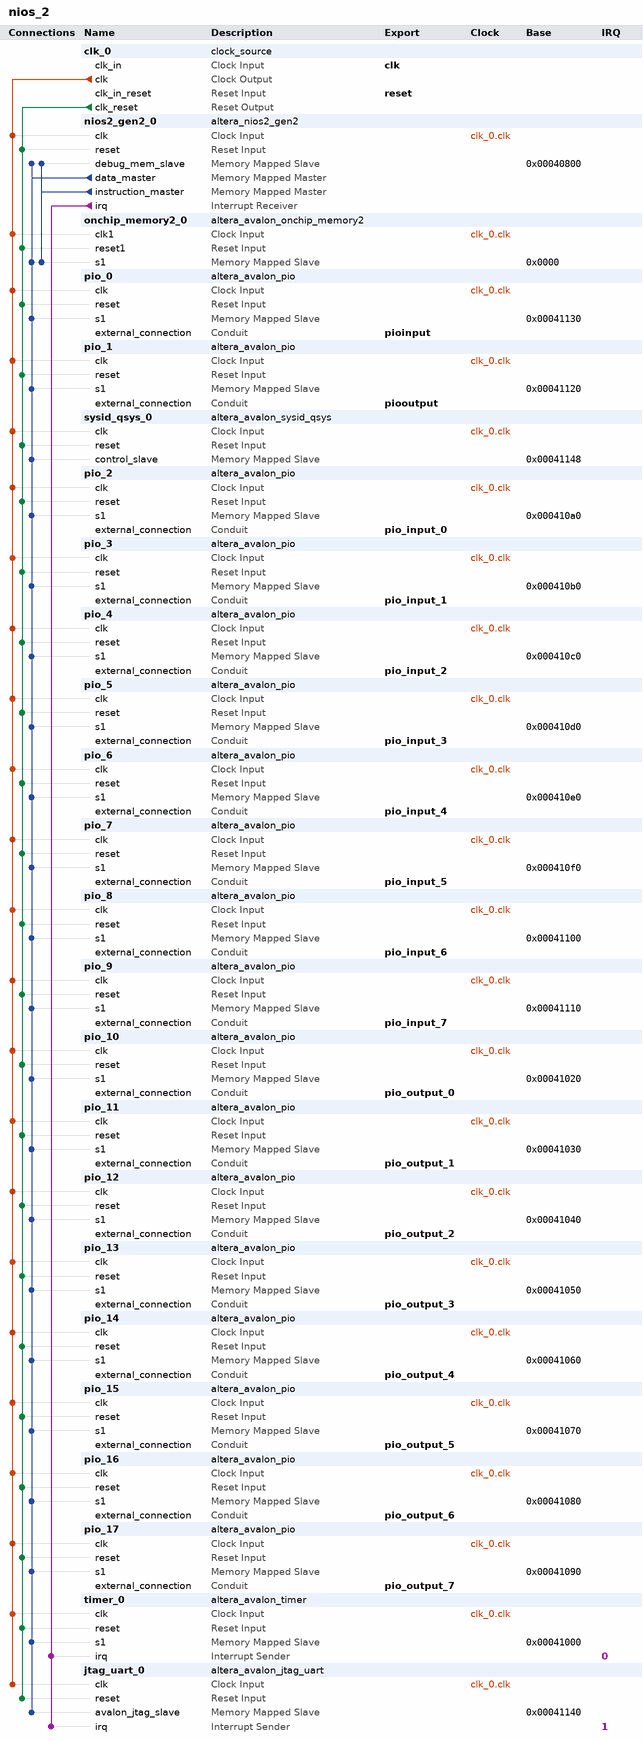
[diagram p0: system contents]
# Platform Designer (Qsys) system nios_2, Cyclone V 5CSEMA5F31C6
# Parameters at their usual value, and those the tool derives, are not listed.
package require -exact qsys 18.0
create_system nios_2
set_project_property DEVICE_FAMILY {Cyclone V}
set_project_property DEVICE 5CSEMA5F31C6

add_instance clk_0 clock_source 18.0
set_instance_parameter_value clk_0 clockFrequency 50000000

add_instance nios2_gen2_0 altera_nios2_gen2 18.0
set_instance_parameter_value nios2_gen2_0 dcache_size 2048
set_instance_parameter_value nios2_gen2_0 exceptionSlave onchip_memory2_0.s1
set_instance_parameter_value nios2_gen2_0 icache_size 4096
set_instance_parameter_value nios2_gen2_0 impl Fast
set_instance_parameter_value nios2_gen2_0 resetSlave onchip_memory2_0.s1

add_instance onchip_memory2_0 altera_avalon_onchip_memory2 18.0
set_instance_parameter_value onchip_memory2_0 dataWidth 32
set_instance_parameter_value onchip_memory2_0 dualPort false
set_instance_parameter_value onchip_memory2_0 initMemContent true
set_instance_parameter_value onchip_memory2_0 initializationFileName onchip_mem.hex
set_instance_parameter_value onchip_memory2_0 memorySize 131072

add_instance pio_0 altera_avalon_pio 18.0
set_instance_parameter_value pio_0 direction Input
set_instance_parameter_value pio_0 width 8

add_instance pio_1 altera_avalon_pio 18.0
set_instance_parameter_value pio_1 direction Output
set_instance_parameter_value pio_1 width 8

add_instance sysid_qsys_0 altera_avalon_sysid_qsys 18.0
set_instance_parameter_value sysid_qsys_0 id 0

add_instance pio_2 altera_avalon_pio 18.0
set_instance_parameter_value pio_2 direction Input
set_instance_parameter_value pio_2 width 8

add_instance pio_3 altera_avalon_pio 18.0
set_instance_parameter_value pio_3 direction Input
set_instance_parameter_value pio_3 width 8

add_instance pio_4 altera_avalon_pio 18.0
set_instance_parameter_value pio_4 direction Input
set_instance_parameter_value pio_4 width 8

add_instance pio_5 altera_avalon_pio 18.0
set_instance_parameter_value pio_5 direction Input
set_instance_parameter_value pio_5 width 8

add_instance pio_6 altera_avalon_pio 18.0
set_instance_parameter_value pio_6 direction Input
set_instance_parameter_value pio_6 width 8

add_instance pio_7 altera_avalon_pio 18.0
set_instance_parameter_value pio_7 direction Input
set_instance_parameter_value pio_7 width 8

add_instance pio_8 altera_avalon_pio 18.0
set_instance_parameter_value pio_8 direction Input
set_instance_parameter_value pio_8 width 8

add_instance pio_9 altera_avalon_pio 18.0
set_instance_parameter_value pio_9 direction Input
set_instance_parameter_value pio_9 width 8

add_instance pio_10 altera_avalon_pio 18.0
set_instance_parameter_value pio_10 direction Output
set_instance_parameter_value pio_10 width 8

add_instance pio_11 altera_avalon_pio 18.0
set_instance_parameter_value pio_11 direction Output
set_instance_parameter_value pio_11 width 8

add_instance pio_12 altera_avalon_pio 18.0
set_instance_parameter_value pio_12 direction Output
set_instance_parameter_value pio_12 width 8

add_instance pio_13 altera_avalon_pio 18.0
set_instance_parameter_value pio_13 direction Output
set_instance_parameter_value pio_13 width 8

add_instance pio_14 altera_avalon_pio 18.0
set_instance_parameter_value pio_14 direction Output
set_instance_parameter_value pio_14 width 8

add_instance pio_15 altera_avalon_pio 18.0
set_instance_parameter_value pio_15 direction Output
set_instance_parameter_value pio_15 width 8

add_instance pio_16 altera_avalon_pio 18.0
set_instance_parameter_value pio_16 direction Output
set_instance_parameter_value pio_16 width 8

add_instance pio_17 altera_avalon_pio 18.0
set_instance_parameter_value pio_17 direction Output
set_instance_parameter_value pio_17 width 8

add_instance timer_0 altera_avalon_timer 18.0
set_instance_parameter_value timer_0 period 1
set_instance_parameter_value timer_0 periodUnits SEC

add_instance jtag_uart_0 altera_avalon_jtag_uart 18.0
set_instance_parameter_value jtag_uart_0 simInteractiveOptions NO_INTERACTIVE_WINDOWS

# connections
add_connection clk_0.clk jtag_uart_0.clk clock
add_connection clk_0.clk nios2_gen2_0.clk clock
add_connection clk_0.clk onchip_memory2_0.clk1 clock
add_connection clk_0.clk pio_0.clk clock
add_connection clk_0.clk pio_1.clk clock
add_connection clk_0.clk pio_2.clk clock
add_connection clk_0.clk pio_3.clk clock
add_connection clk_0.clk pio_4.clk clock
add_connection clk_0.clk pio_5.clk clock
add_connection clk_0.clk pio_6.clk clock
add_connection clk_0.clk pio_7.clk clock
add_connection clk_0.clk pio_8.clk clock
add_connection clk_0.clk pio_9.clk clock
add_connection clk_0.clk pio_10.clk clock
add_connection clk_0.clk pio_11.clk clock
add_connection clk_0.clk pio_12.clk clock
add_connection clk_0.clk pio_13.clk clock
add_connection clk_0.clk pio_14.clk clock
add_connection clk_0.clk pio_15.clk clock
add_connection clk_0.clk pio_16.clk clock
add_connection clk_0.clk pio_17.clk clock
add_connection clk_0.clk sysid_qsys_0.clk clock
add_connection clk_0.clk timer_0.clk clock
add_connection clk_0.clk_reset jtag_uart_0.reset reset
add_connection clk_0.clk_reset nios2_gen2_0.reset reset
add_connection clk_0.clk_reset onchip_memory2_0.reset1 reset
add_connection clk_0.clk_reset pio_0.reset reset
add_connection clk_0.clk_reset pio_1.reset reset
add_connection clk_0.clk_reset pio_2.reset reset
add_connection clk_0.clk_reset pio_3.reset reset
add_connection clk_0.clk_reset pio_4.reset reset
add_connection clk_0.clk_reset pio_5.reset reset
add_connection clk_0.clk_reset pio_6.reset reset
add_connection clk_0.clk_reset pio_7.reset reset
add_connection clk_0.clk_reset pio_8.reset reset
add_connection clk_0.clk_reset pio_9.reset reset
add_connection clk_0.clk_reset pio_10.reset reset
add_connection clk_0.clk_reset pio_11.reset reset
add_connection clk_0.clk_reset pio_12.reset reset
add_connection clk_0.clk_reset pio_13.reset reset
add_connection clk_0.clk_reset pio_14.reset reset
add_connection clk_0.clk_reset pio_15.reset reset
add_connection clk_0.clk_reset pio_16.reset reset
add_connection clk_0.clk_reset pio_17.reset reset
add_connection clk_0.clk_reset sysid_qsys_0.reset reset
add_connection clk_0.clk_reset timer_0.reset reset
add_connection nios2_gen2_0.data_master jtag_uart_0.avalon_jtag_slave avalon
set_connection_parameter_value nios2_gen2_0.data_master/jtag_uart_0.avalon_jtag_slave baseAddress 0x00041140
add_connection nios2_gen2_0.data_master nios2_gen2_0.debug_mem_slave avalon
set_connection_parameter_value nios2_gen2_0.data_master/nios2_gen2_0.debug_mem_slave baseAddress 0x00040800
add_connection nios2_gen2_0.data_master onchip_memory2_0.s1 avalon
set_connection_parameter_value nios2_gen2_0.data_master/onchip_memory2_0.s1 baseAddress 0x0000
add_connection nios2_gen2_0.data_master pio_0.s1 avalon
set_connection_parameter_value nios2_gen2_0.data_master/pio_0.s1 baseAddress 0x00041130
add_connection nios2_gen2_0.data_master pio_1.s1 avalon
set_connection_parameter_value nios2_gen2_0.data_master/pio_1.s1 baseAddress 0x00041120
add_connection nios2_gen2_0.data_master pio_2.s1 avalon
set_connection_parameter_value nios2_gen2_0.data_master/pio_2.s1 baseAddress 0x000410a0
add_connection nios2_gen2_0.data_master pio_3.s1 avalon
set_connection_parameter_value nios2_gen2_0.data_master/pio_3.s1 baseAddress 0x000410b0
add_connection nios2_gen2_0.data_master pio_4.s1 avalon
set_connection_parameter_value nios2_gen2_0.data_master/pio_4.s1 baseAddress 0x000410c0
add_connection nios2_gen2_0.data_master pio_5.s1 avalon
set_connection_parameter_value nios2_gen2_0.data_master/pio_5.s1 baseAddress 0x000410d0
add_connection nios2_gen2_0.data_master pio_6.s1 avalon
set_connection_parameter_value nios2_gen2_0.data_master/pio_6.s1 baseAddress 0x000410e0
add_connection nios2_gen2_0.data_master pio_7.s1 avalon
set_connection_parameter_value nios2_gen2_0.data_master/pio_7.s1 baseAddress 0x000410f0
add_connection nios2_gen2_0.data_master pio_8.s1 avalon
set_connection_parameter_value nios2_gen2_0.data_master/pio_8.s1 baseAddress 0x00041100
add_connection nios2_gen2_0.data_master pio_9.s1 avalon
set_connection_parameter_value nios2_gen2_0.data_master/pio_9.s1 baseAddress 0x00041110
add_connection nios2_gen2_0.data_master pio_10.s1 avalon
set_connection_parameter_value nios2_gen2_0.data_master/pio_10.s1 baseAddress 0x00041020
add_connection nios2_gen2_0.data_master pio_11.s1 avalon
set_connection_parameter_value nios2_gen2_0.data_master/pio_11.s1 baseAddress 0x00041030
add_connection nios2_gen2_0.data_master pio_12.s1 avalon
set_connection_parameter_value nios2_gen2_0.data_master/pio_12.s1 baseAddress 0x00041040
add_connection nios2_gen2_0.data_master pio_13.s1 avalon
set_connection_parameter_value nios2_gen2_0.data_master/pio_13.s1 baseAddress 0x00041050
add_connection nios2_gen2_0.data_master pio_14.s1 avalon
set_connection_parameter_value nios2_gen2_0.data_master/pio_14.s1 baseAddress 0x00041060
add_connection nios2_gen2_0.data_master pio_15.s1 avalon
set_connection_parameter_value nios2_gen2_0.data_master/pio_15.s1 baseAddress 0x00041070
add_connection nios2_gen2_0.data_master pio_16.s1 avalon
set_connection_parameter_value nios2_gen2_0.data_master/pio_16.s1 baseAddress 0x00041080
add_connection nios2_gen2_0.data_master pio_17.s1 avalon
set_connection_parameter_value nios2_gen2_0.data_master/pio_17.s1 baseAddress 0x00041090
add_connection nios2_gen2_0.data_master sysid_qsys_0.control_slave avalon
set_connection_parameter_value nios2_gen2_0.data_master/sysid_qsys_0.control_slave baseAddress 0x00041148
add_connection nios2_gen2_0.data_master timer_0.s1 avalon
set_connection_parameter_value nios2_gen2_0.data_master/timer_0.s1 baseAddress 0x00041000
add_connection nios2_gen2_0.instruction_master nios2_gen2_0.debug_mem_slave avalon
set_connection_parameter_value nios2_gen2_0.instruction_master/nios2_gen2_0.debug_mem_slave baseAddress 0x00040800
add_connection nios2_gen2_0.instruction_master onchip_memory2_0.s1 avalon
set_connection_parameter_value nios2_gen2_0.instruction_master/onchip_memory2_0.s1 baseAddress 0x0000
add_connection nios2_gen2_0.irq jtag_uart_0.irq interrupt
set_connection_parameter_value nios2_gen2_0.irq/jtag_uart_0.irq irqNumber 1
add_connection nios2_gen2_0.irq timer_0.irq interrupt
set_connection_parameter_value nios2_gen2_0.irq/timer_0.irq irqNumber 0

# exported interfaces
add_interface clk clock sink
set_interface_property clk EXPORT_OF clk_0.clk_in
add_interface pio_input_0 conduit end
set_interface_property pio_input_0 EXPORT_OF pio_2.external_connection
add_interface pio_input_1 conduit end
set_interface_property pio_input_1 EXPORT_OF pio_3.external_connection
add_interface pio_input_2 conduit end
set_interface_property pio_input_2 EXPORT_OF pio_4.external_connection
add_interface pio_input_3 conduit end
set_interface_property pio_input_3 EXPORT_OF pio_5.external_connection
add_interface pio_input_4 conduit end
set_interface_property pio_input_4 EXPORT_OF pio_6.external_connection
add_interface pio_input_5 conduit end
set_interface_property pio_input_5 EXPORT_OF pio_7.external_connection
add_interface pio_input_6 conduit end
set_interface_property pio_input_6 EXPORT_OF pio_8.external_connection
add_interface pio_input_7 conduit end
set_interface_property pio_input_7 EXPORT_OF pio_9.external_connection
add_interface pio_output_0 conduit end
set_interface_property pio_output_0 EXPORT_OF pio_10.external_connection
add_interface pio_output_1 conduit end
set_interface_property pio_output_1 EXPORT_OF pio_11.external_connection
add_interface pio_output_2 conduit end
set_interface_property pio_output_2 EXPORT_OF pio_12.external_connection
add_interface pio_output_3 conduit end
set_interface_property pio_output_3 EXPORT_OF pio_13.external_connection
add_interface pio_output_4 conduit end
set_interface_property pio_output_4 EXPORT_OF pio_14.external_connection
add_interface pio_output_5 conduit end
set_interface_property pio_output_5 EXPORT_OF pio_15.external_connection
add_interface pio_output_6 conduit end
set_interface_property pio_output_6 EXPORT_OF pio_16.external_connection
add_interface pio_output_7 conduit end
set_interface_property pio_output_7 EXPORT_OF pio_17.external_connection
add_interface pioinput conduit end
set_interface_property pioinput EXPORT_OF pio_0.external_connection
add_interface piooutput conduit end
set_interface_property piooutput EXPORT_OF pio_1.external_connection
add_interface reset reset sink
set_interface_property reset EXPORT_OF clk_0.clk_in_reset

set_interconnect_requirement {$system} qsys_mm.clockCrossingAdapter HANDSHAKE
set_interconnect_requirement {$system} qsys_mm.enableEccProtection FALSE
set_interconnect_requirement {$system} qsys_mm.insertDefaultSlave FALSE
set_interconnect_requirement {$system} qsys_mm.maxAdditionalLatency 1

save_system nios_2.qsys
